# EAGLE design Hypertronicsboard (EAGLE 8.6.0)
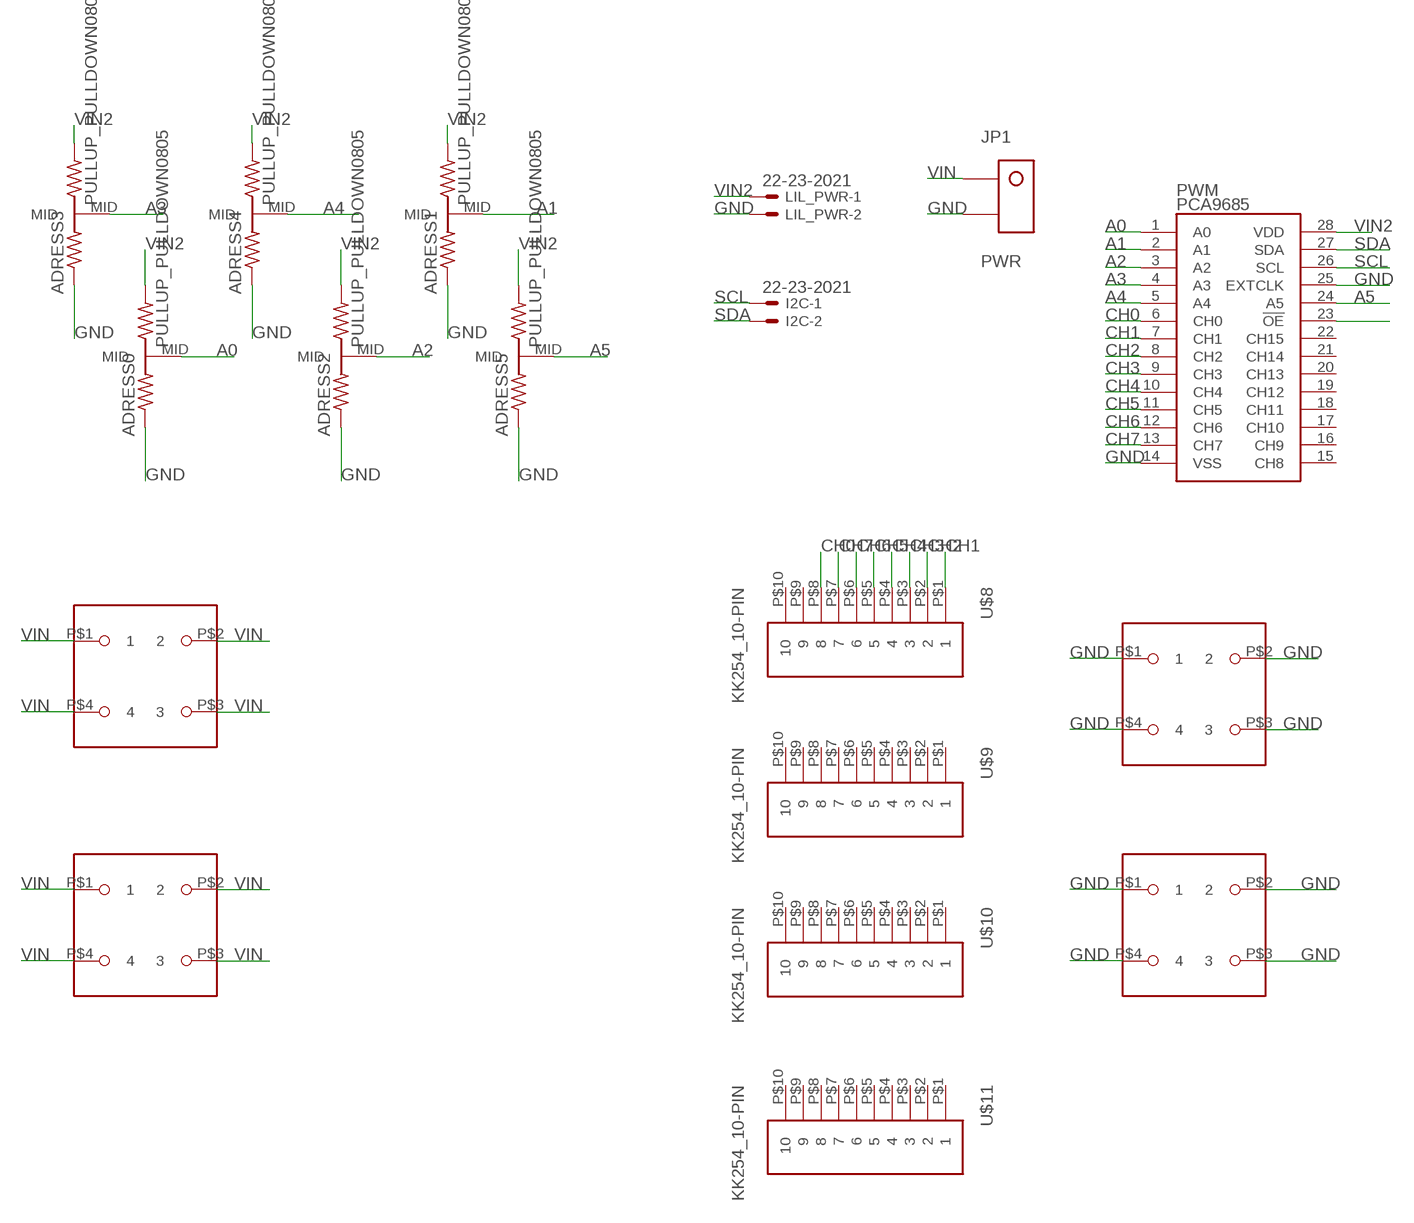
[diagram p0: schematic, sheet 1]

## Parts
ADRESS0  PULLUP_PULLDOWN0805  [PULLUP_PULLDOWN_0805]
ADRESS1  PULLUP_PULLDOWN0805  [PULLUP_PULLDOWN_0805]
ADRESS2  PULLUP_PULLDOWN0805  [PULLUP_PULLDOWN_0805]
ADRESS3  PULLUP_PULLDOWN0805  [PULLUP_PULLDOWN_0805]
ADRESS4  PULLUP_PULLDOWN0805  [PULLUP_PULLDOWN_0805]
ADRESS5  PULLUP_PULLDOWN0805  [PULLUP_PULLDOWN_0805]
I2C  22-23-2021  [22-23-2021]
JP1  PWR  2_SUPERSABRE  [SUPERSABRE_2CIRCUIT]
LIL_PWR  22-23-2021  [22-23-2021]
PWM  PCA9685  [TSSOP-28_4MM]
U$1  BCS-106-L-D-PE-BE  [4-PIN-BIGPOWER]
U$2  BCS-106-L-D-PE-BE  [4-PIN-BIGPOWER]
U$3  BCS-106-L-D-PE-BE  [4-PIN-BIGPOWER]
U$4  BCS-106-L-D-PE-BE  [4-PIN-BIGPOWER]
U$8  KK254_10-PIN  [KK254_10-PIN]
U$9  KK254_10-PIN  [KK254_10-PIN]
U$10  KK254_10-PIN  [KK254_10-PIN]
U$11  KK254_10-PIN  [KK254_10-PIN]

## Nets
A0: ADRESS0.MID PWM.1(A0)
A1: ADRESS1.MID PWM.2(A1)
A2: ADRESS2.MID PWM.3(A2)
A3: ADRESS3.MID PWM.4(A3)
A4: ADRESS4.MID PWM.5(A4)
A5: ADRESS5.MID PWM.24(A5)
CH0: PWM.6(CH0) U$8.P$8
CH1: PWM.7(CH1) U$8.P$1
CH2: PWM.8(CH2) U$8.P$2
CH3: PWM.9(CH3) U$8.P$3
CH4: PWM.10(CH4) U$8.P$4
CH5: PWM.11(CH5) U$8.P$5
CH6: PWM.12(CH6) U$8.P$6
CH7: PWM.13(CH7) U$8.P$7
GND: ADRESS0.GND ADRESS1.GND ADRESS2.GND ADRESS3.GND ADRESS4.GND ADRESS5.GND JP1.P$2 LIL_PWR.2 PWM.14(VSS) PWM.25(EXTCLK) U$3.P$1 U$3.P$2 U$3.P$3 U$3.P$4 U$4.P$1 U$4.P$2 U$4.P$3 U$4.P$4
N$1: PWM.23(!OE)
SCL: I2C.1 PWM.26(SCL)
SDA: I2C.2 PWM.27(SDA)
VIN: JP1.P$1 U$1.P$1 U$1.P$2 U$1.P$3 U$1.P$4 U$2.P$1 U$2.P$2 U$2.P$3 U$2.P$4
VIN2: ADRESS0.VCC(PWR) ADRESS1.VCC(PWR) ADRESS2.VCC(PWR) ADRESS3.VCC(PWR) ADRESS4.VCC(PWR) ADRESS5.VCC(PWR) LIL_PWR.1 PWM.28(VDD)
Unconnected: PWM.15(CH8) PWM.16(CH9) PWM.17(CH10) PWM.18(CH11) PWM.19(CH12) PWM.20(CH13) PWM.21(CH14) PWM.22(CH15) U$8.P$9 U$8.P$10 U$9.P$1 U$9.P$2 U$9.P$3 U$9.P$4 U$9.P$5 U$9.P$6 U$9.P$7 U$9.P$8 U$9.P$9 U$9.P$10 U$10.P$1 U$10.P$2 U$10.P$3 U$10.P$4 U$10.P$5 U$10.P$6 U$10.P$7 U$10.P$8 U$10.P$9 U$10.P$10 U$11.P$1 U$11.P$2 U$11.P$3 U$11.P$4 U$11.P$5 U$11.P$6 U$11.P$7 U$11.P$8 U$11.P$9 U$11.P$10

## Library data of the parts
ADRESS0 ADRESS1-ADRESS5 = resistor:PULLUP_PULLDOWN
I2C LIL_PWR = con-molex_MOD:22-23-2021: .100" (2.54mm) Center Header - 2 Pin; MF: MOLEX; MPN: 22-23-2021; OC_FARNELL: 1462926; OC_NEWARK: 25C3832
JP1 = molex:2_SUPERSABRE: Molex SuperSabre 2-pin vertical header
PWM = NXP:PCA9685: 16-channel 12-bit PWM I2C interface Internal Oscillator 40Hz to 1kHz Can be totem pole or open collector 2.3V to 5.5V; PROD_ID: IC-12240
U$1-U$4 = samtec:BCS-106-L-D-PE-BE
U$8-U$11 = molex:KK254_10-PIN: KK254 10-pin Datasheet <http://www.molex.com/molex/products/datasheet.jsp?part=active/0022102101_PCB_HEADERS.xml>

## Board
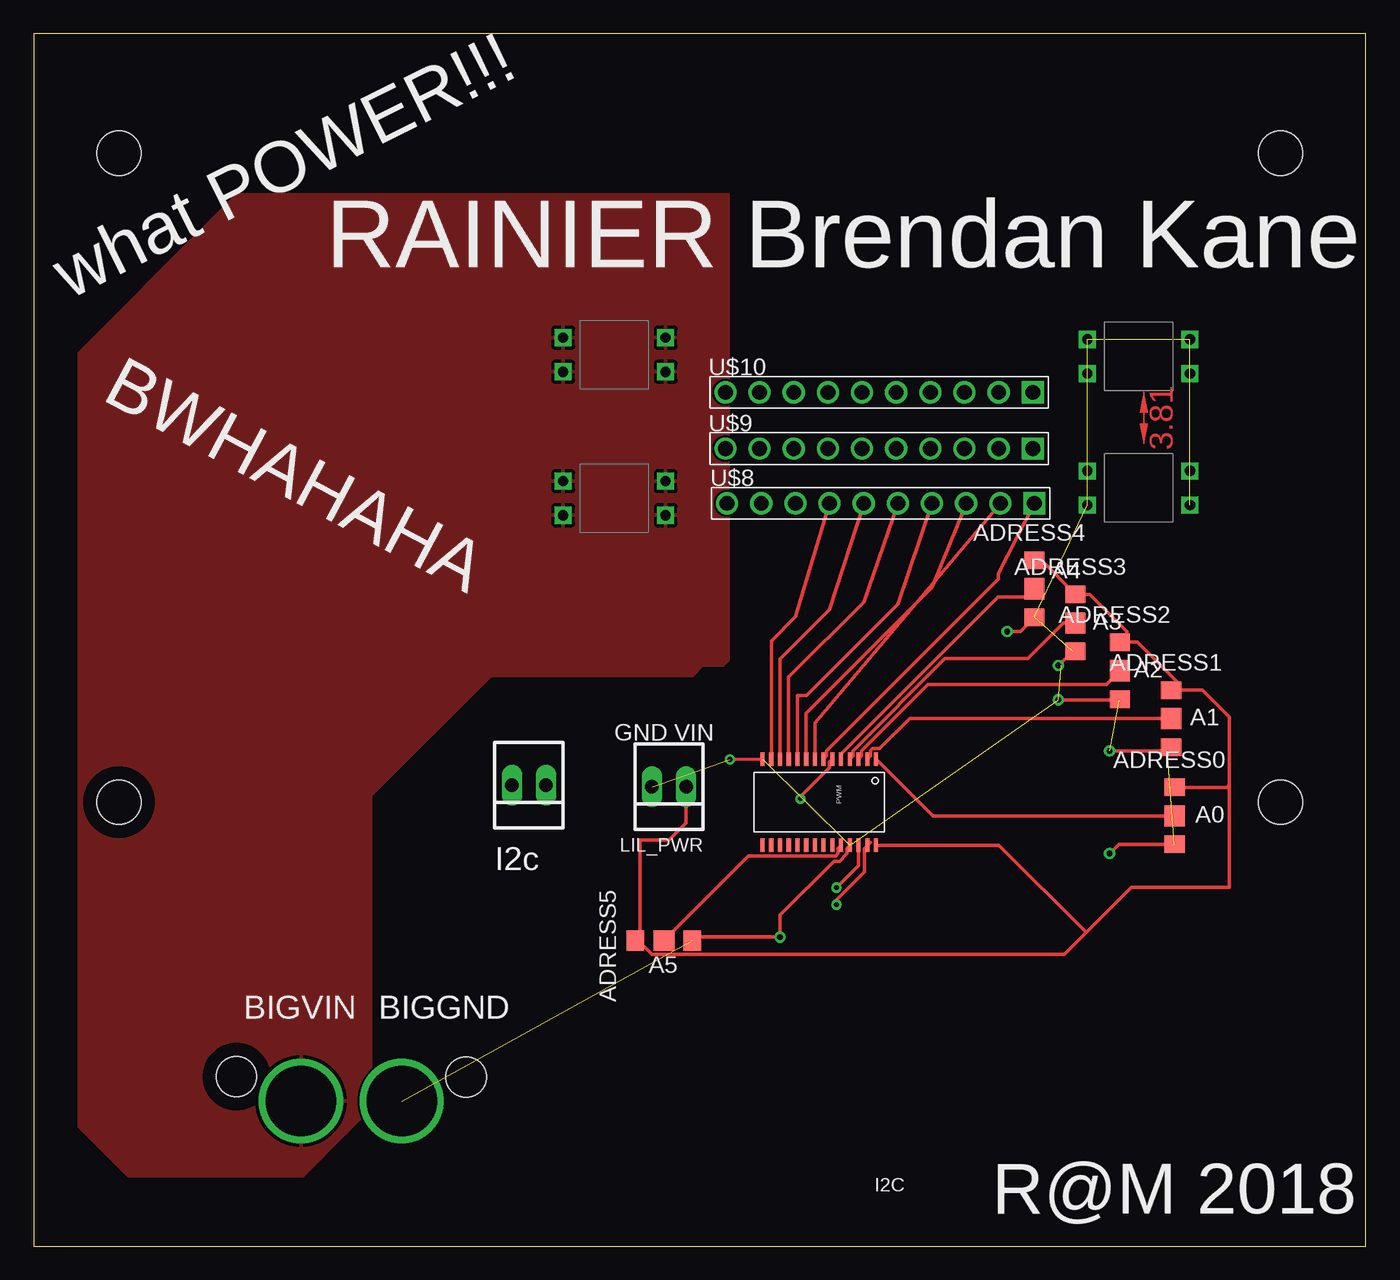
[diagram p1: board, top side]
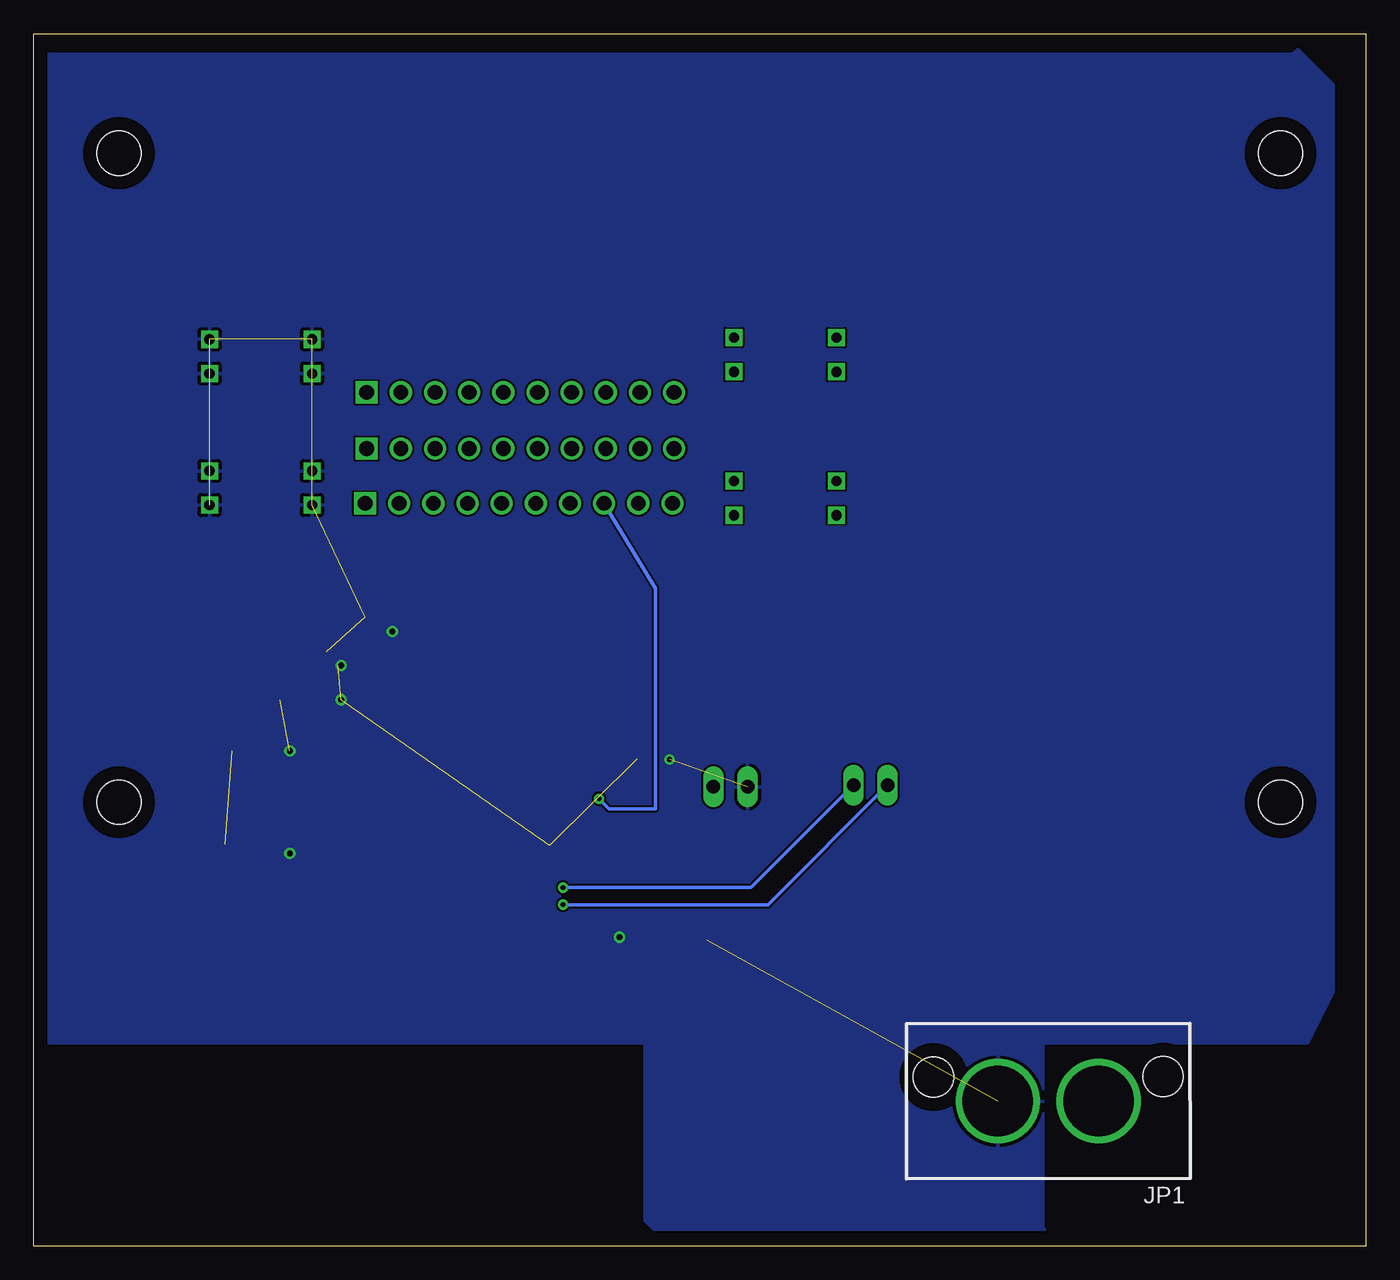
[diagram p2: board, bottom side, seen from below]

Size 99.06 x 90.17 mm. Coordinates in mm from the lower left corner, seen from the top.
Outline: 0,0 99.06,0 99.06,90.17 0,90.17 0,0
Copper layers (1*16): Top 0.035mm / dielectric 1.5mm / Bottom 0.035mm
Design rules "default": minimum track width 6mil, minimum drill 0.35mm, track to track 6mil, track to pad 6mil, pad to pad 6mil, via to via 6mil, smd to smd 6mil, copper to edge 40mil, drill to drill 6mil, minimum pad ring 10mil, minimum via ring 8mil, stop-mask expansion 4mil, vias tented up to drill 0mil, thermal gap 10mil
Holes 3.3 mm at 6.35,33.02 6.35,81.28 92.71,81.28 92.71,33.02

### Footprints (pad centres in the part's own frame; a part is rotated, then mirrored left to right if it is on the bottom)
PULLUP_PULLDOWN_0805 = smd 1.5 x 1.3: GND 0,-2.12; VCC 0,2.12 | smd 1.5 x 1.57: MID 0,0
22-23-2021 = drill 1 long: 1 -1.27,0; 2 1.27,0
SUPERSABRE_2CIRCUIT = drill 5.25: P$1 -3.747,0; P$2 3.747,0 | hole 2.997: -8.534,-1.803; 8.534,-1.803
TSSOP-28_4MM = smd 1 x 0.3: 1 -3.2,4.225; 2 -3.2,3.575; 3 -3.2,2.925; 4 -3.2,2.275; 5 -3.2,1.625; 6 -3.2,0.975; 7 -3.2,0.325; 8 -3.2,-0.325; 9 -3.2,-0.975; 10 -3.2,-1.625; 11 -3.2,-2.275; 12 -3.2,-2.925; 13 -3.2,-3.575; 14 -3.2,-4.225; 15 3.2,-4.225; 16 3.2,-3.575; 17 3.2,-2.925; 18 3.2,-2.275; 19 3.2,-1.625; 20 3.2,-0.975; 21 3.2,-0.325; 22 3.2,0.325; 23 3.2,0.975; 24 3.2,1.625; 25 3.2,2.275; 26 3.2,2.925; 27 3.2,3.575; 28 3.2,4.225
4-PIN-BIGPOWER = drill 0.762 square: P$1 -1.27,3.81; P$2 1.27,3.81; P$3 1.27,-3.81; P$4 -1.27,-3.81
KK254_10-PIN = drill 1.1 square: P$1 11.43,0 | drill 1.1: P$2 8.89,0; P$3 6.35,0; P$4 3.81,0; P$5 1.27,0; P$6 -1.27,0; P$7 -3.81,0; P$8 -6.35,0; P$9 -8.89,0; P$10 -11.43,0

### Placement (x,y rotation side)
ADRESS0  84.84,32 0 top
ADRESS1  84.58,39.24 0 top
ADRESS2  80.77,42.8 0 top
ADRESS3  77.47,46.35 0 top
ADRESS4  74.42,48.9 0 top
ADRESS5  46.86,22.73 90 top
I2C  36.83,34.29 180 top
JP1  23.62,10.79 180.1 bottom
LIL_PWR  47.24,34.16 180 top
PWM  58.42,33.02 270 top
U$1  43.18,66.29 270 top
U$2  43.18,55.63 270 top
U$3  82.17,56.39 270 top
U$4  82.17,66.17 90 top
U$8  62.99,55.24 0 top
U$9  62.87,59.31 0 top
U$10  62.87,63.5 0 top
U$11  8.89,-62.23 0 top  (outside the outline)

### Tracks (layer width: path | path; a pad name or v marks a point on that pad's centre or on a via)
A0
  Top 0.254: ADRESS0.MID 66.86,32 PWM.1
A1
  Top 0.254: ADRESS1.MID 65.15,39.24 62.91,37 62.38,37 62.22,36.84 62.22,36.44 PWM.2
A2
  Top 0.254: ADRESS2.MID 79.76,41.78 66.51,41.78 61.57,36.84 61.57,36.44 PWM.3
A3
  Top 0.254: ADRESS3.MID 76.58,46.35 73.91,43.69 67.77,43.69 60.92,36.84 60.92,36.44 PWM.4
A4
  Top 0.254: ADRESS4.MID 73.79,48.26 71.69,48.26 60.05,36.62 PWM.5
A5
  Top 0.254: ADRESS5.MID 53.17,29.04 59.66,29.04 59.82,29.2 59.82,29.6 PWM.24
CH0  (via drill 0.35)
  Top 0.254: PWM.6 59.17,36 59.17,35.6 57.02,33.45 v57.02,33.27
  Bottom 0.254: v57.02,33.27 56.26,32.51 52.83,32.51 52.83,48.9 U$8.P$8
CH1
  Top 0.254: PWM.7 58.97,36.44 58.97,36.84 71.74,49.61 71.74,50.02 U$8.P$1
CH2
  Top 0.254: U$8.P$2 58.09,38.92 PWM.8
CH3
  Top 0.254: PWM.9 57.45,39.62 66.8,48.98 U$8.P$3
CH4
  Top 0.254: PWM.10 56.8,40.97 57.48,40.97 64.26,47.75 U$8.P$4
CH5
  Top 0.254: PWM.11 56.15,42.32 61.72,47.9 U$8.P$5
CH6
  Top 0.254: PWM.12 55.49,43.67 59.18,47.35 U$8.P$6
CH7
  Top 0.254: PWM.13 54.84,45.02 56.64,46.81 U$8.P$7
GND  (via drill 0.35, 0.43)  (16 unrouted)
  Top 0.254: ADRESS0.GND 80.68,29.88 v80.01,29.21 | ADRESS1.GND arc-90 84.29,36.83 v80.01,36.83 | ADRESS2.GND arc-90 80.73,40.64 v76.2,40.64 | 76.42,43.18 v76.2,43.18 77.25,44.23 ADRESS3.GND | PWM.14 arc-90 54.19,36.23 v51.77,36.2 | ADRESS4.GND 73.37,45.72 v72.39,45.72 | ADRESS5.GND 49.24,22.99 v55.5,22.99 55.5,24.62 59.51,28.63 59.9,28.63 60.47,29.2 60.47,29.6 PWM.25
  pour Bottom: 4.32,15.11 109.98,15.11 111.38,16.51 111.38,85.6 108.33,88.65 5.46,88.65 5.08,89.03 2.41,86.36 2.41,18.92
  pour Bottom: 24,18.16 24,1.4 23.88,1.27 52.96,1.27 53.59,1.91 53.59,17.02 53.47,17.14
SCL  (via drill 0.35)
  Top 0.254: PWM.26 61.34,28.32 v59.69,26.67
  Bottom 0.254: v59.69,26.67 45.72,26.67 I2C.1
SDA  (via drill 0.35)
  Top 0.254: 62.22,30.04 PWM.27 61.77,29.6 61.77,27.82 59.69,25.74 v59.69,25.4
  Bottom 0.254: v59.69,25.4 44.45,25.4 I2C.2
VIN
  pour Top: 6.99,5.21 20.07,5.21 23.24,8.38 25.15,10.29 25.15,33.53 34.04,42.42 49.02,42.42 49.78,43.18 51.31,43.18 51.69,43.56 51.69,78.23 15.11,78.23 12.95,76.07 3.3,66.42 3.3,11.56 3.3,8.89
VIN2
  Top 0.254: LIL_PWR.1 48.51,31.5 47.24,30.23 45.09,30.23 45.09,23.07 ADRESS5.VCC 44.93,22.73 45.96,21.7 76.66,21.7 78.28,23.32 | 78.28,23.32 71.78,29.82 PWM.28 | 85.09,41.36 86.91,41.36 88.9,39.37 88.9,34.29 | 85.09,41.36 ADRESS1.VCC | 85.09,41.36 85.09,41.91 82.08,44.92 ADRESS2.VCC 81.28,45.43 81.28,45.72 78.53,48.48 ADRESS3.VCC 74.93,51.02 ADRESS4.VCC | 78.28,23.32 81.62,26.67 88.9,26.67 88.9,34.29 | ADRESS0.VCC 88.73,34.12 88.9,34.29
(copper drawn outside any net)
  shapes: Top area x1

### Text on the board
tPlace: A4 | A3 | A2 | A1 | GND | VIN | A0 | A5 | BIGVIN | BIGGND | R@M 2018
tSilk: I2c
_tsilk: RAINIER Brendan Kane | what POWER!!! | BWHAHAHA